# EAGLE design metal detector proto1.1 (EAGLE 9.4.2)
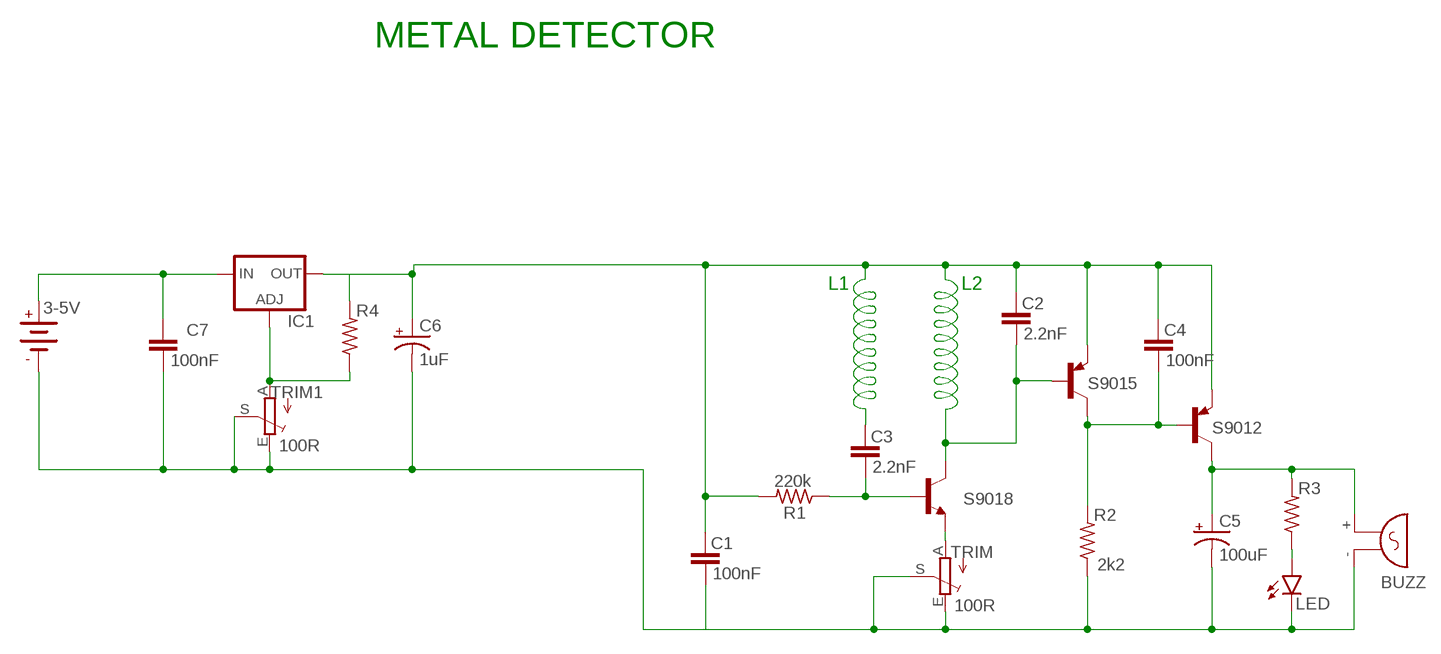
[diagram p0: schematic, sheet 1]

## Parts
3-5V  3-5V  DC_BATT  [AB9V]
BUZZ  F/QMX  [F/QMX]
C1  100nF  CER/FILMBOX.1  [BOX_SMALL]
C2  2.2nF  CER/FILMBOX.1  [BOX_SMALL]
C3  2.2nF  CER/FILMBOX.1  [BOX_SMALL]
C4  100nF  CER/FILMBOX.1  [BOX_SMALL]
C5  100uF  0631  [063_025]
C6  1uF  0631  [063_025]
C7  100nF  CER/FILMBOX.1  [BOX_SMALL]
IC1  LM138-TS  [TO220S]
LED  LED5MM  [LED5MM]
R1  220k  R_.3B  [R0207/3]
R2  2k2  R_.3B  [R0207/3]
R3  R_.3B  [R0207/3]
R4  R_.3B  [R0207/3]
S9012  S9012  [TO92-EBC]
S9015  S9015  [TO92-EBC]
S9018  S9018  [TO92-EBC]
TRIM  100R  TRIM_EU-RJ9W  [RJ9W]
TRIM1  100R  TRIM_EU-RJ9W  [RJ9W]

## Nets
GND: 3-5V.- BUZZ.- C1.2 C5.- C6.- C7.2 LED.K(C) R2.1 TRIM1.E TRIM1.S TRIM.E TRIM.S
N$2: 3-5V.+ C7.1 IC1.3(IN)
N$3: C4.2 R2.2 S9012.2(B) S9015.3(C)
N$4: BUZZ.+ C5.+ R3.2 S9012.3(C)
N$5: LED.A R3.1
N$7: C1.1 C2.1 C2.2 C3.1 C4.1 C6.+ IC1.2(OUT) R1.2 R4.2 S9012.1(E) S9015.1(E) S9015.2(B) S9018.3(C)
N$10: IC1.1(ADJ) R4.1 TRIM1.A
N$15: S9018.1(E) TRIM.A
N$16: C3.2 R1.1 S9018.2(B)

## Notes on the sheet
- METAL DETECTOR
- L1 | L2

## Library data of the parts
3-5V = supply pins:DC_BATT
BUZZ = buzzer:F/QMX: BUZZER Source: Buerklin; OC_FARNELL: unknown; OC_NEWARK: unknown
C1-C4 C7 = capacitors-film:CER/FILM: 47 - 120pF Xicon Ceramic Disc 2.5mm lead spacing
C5 C6 = capacitors-elec:063: 33 - 220uF Xicon values at Mouser.com 10V: 220uF; 16V: 100uF; 25V: 100uF; 50V: 33uF
IC1 = v-reg:LM138-TS: VOLTAGE REGULATOR
LED = diodes_mod:LED
R1-R4 = resistors:R_
S9012 = transistors:S9012
S9015 = transistors:S9015
S9018 = transistors:S9018
TRIM TRIM1 = pot:TRIM_EU-: POTENTIOMETER

## Module LM317
Ports: 

### Library data of the parts

## Board
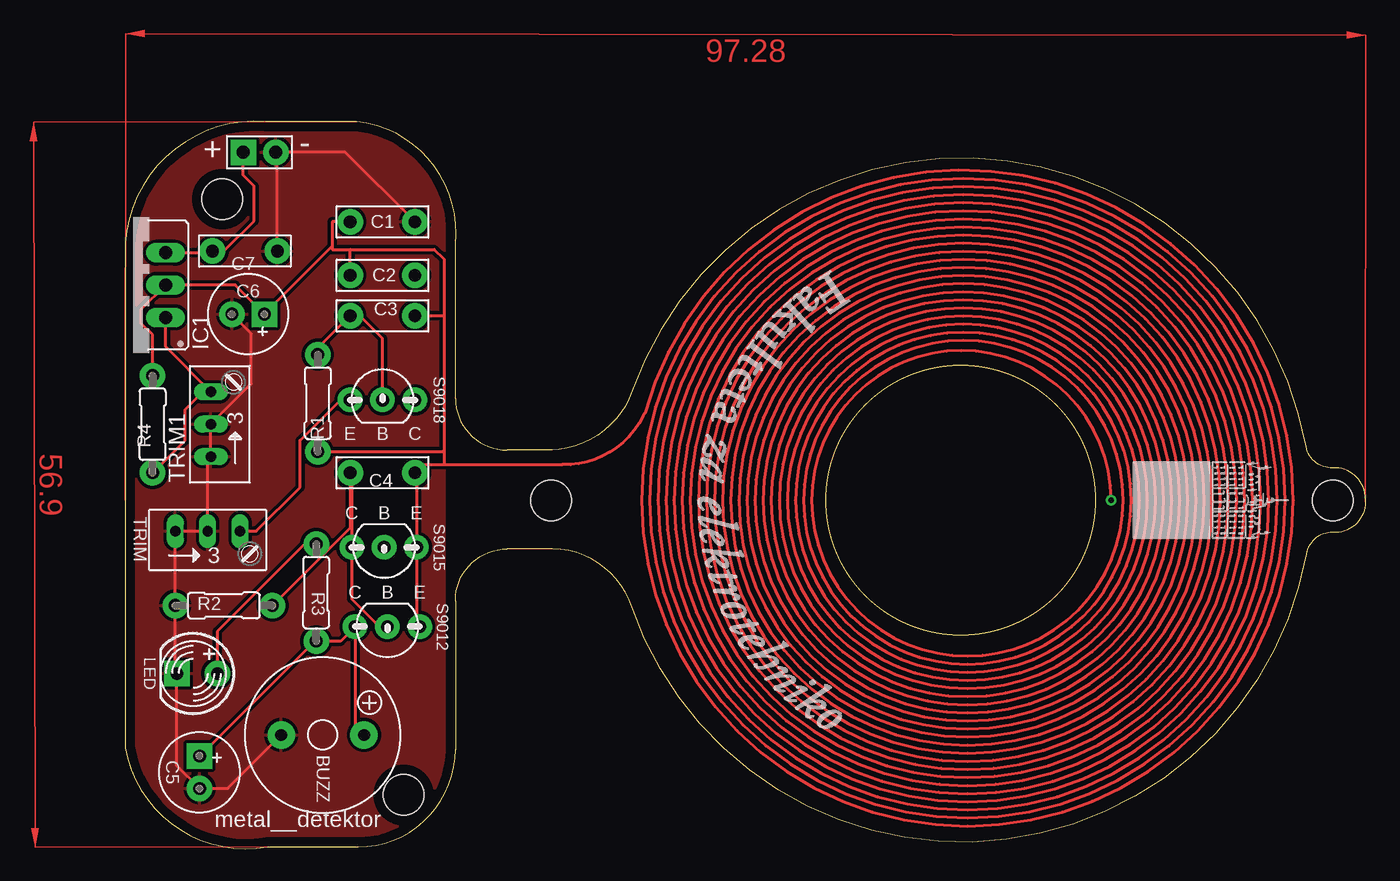
[diagram p1: board, top side]
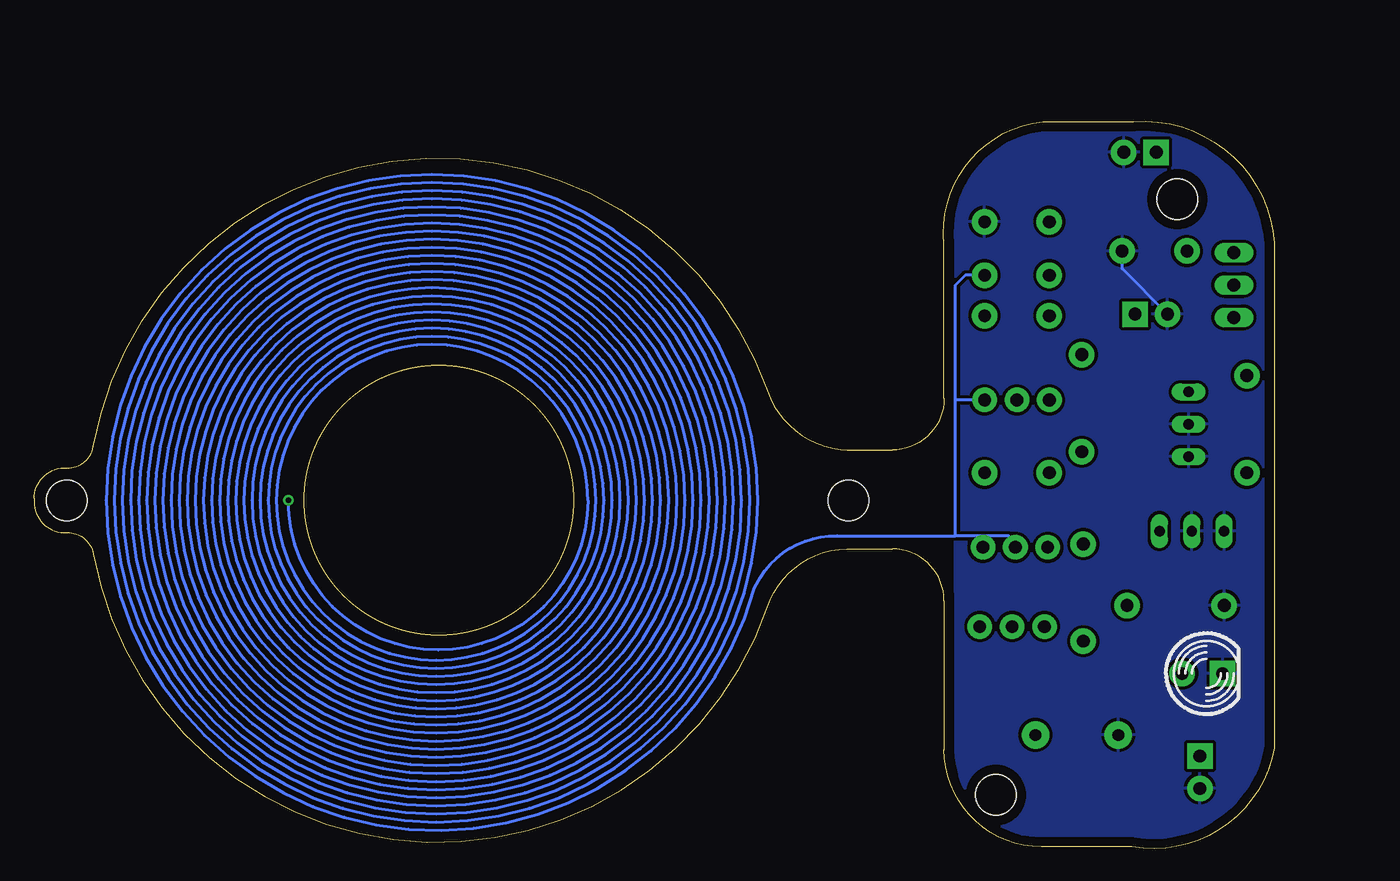
[diagram p2: board, bottom side, seen from below]

Size 97.28 x 57.08 mm. Coordinates in mm from the lower left corner, seen from the top.
Outline: 33.53,31.27 33.4,31.27
Outline: 33.4,31.27 29.97,31.27 arc-90 25.91,35.33 25.91,47.4 arc90 18.16,57.05 11.05,57.05 arc90 0,47.52 0,7.9 arc90 11.18,0.15 18.29,0.15 arc90 25.91,7.77 25.91,19.46 arc-90 29.97,23.52 33.53,23.52 arc-71 39.75,18.95 arc151 92.63,23.12 arc-83 94.74,24.79 arc93 97.28,27.2 97.28,27.46 arc93 94.74,29.87 arc-83 92.63,31.55 arc150 39.78,35.92 arc-69 33.4,31.27
Outline: circle at 65.53,27.33 radius 10.57
Copper layers (1*16): Top 0.035mm / dielectric 1.5mm / Bottom 0.035mm
Design rules "default *": minimum track width 10mil, minimum drill 15mil, track to track 10mil, track to pad 10mil, pad to pad 10mil, via to via 8mil, smd to smd 8mil, copper to edge 30mil, drill to drill 8mil, minimum pad ring 10mil, minimum via ring 8mil, stop-mask expansion 4mil, vias tented up to drill 17mil, thermal gap 10mil
Holes 3.2 mm at 7.62,50.95 21.84,4.22 33.4,27.33 94.74,27.33

### Footprints (pad centres in the part's own frame; a part is rotated, then mirrored left to right if it is on the bottom)
AB9V = drill 1 pad 2 square: + 0,1.27 | drill 1 pad 2: - 0,-1.27
F/QMX = drill 0.914 pad 2.159: + 3.251,0; - -3.251,0
BOX_SMALL = drill 1 pad 2: 1 -2.54,0; 2 2.54,0
063_025 = drill 1 pad 2 square: + -1.27,0 | drill 1 pad 2: - 1.27,0
TO220S = drill 1.016 long: 1 -2.54,-2.54; 2 0,-2.54; 3 2.54,-2.54
LED5MM = drill 1 pad 2: A -1.905,0 | drill 1 pad 2 square: K 1.27,0
R0207/3 = drill 1 pad 2: 1 -3.81,0; 2 3.81,0
TO92-EBC = drill 1 pad 1.93: 1 -2.54,0; 2 0,0; 3 2.54,0
RJ9W = drill 0.813 long: A 2.54,0.635; E -2.54,0.635; S 0,0.635

### Placement (x,y rotation side)
3-5V  10.54,54.64 90 top
BUZZ  15.49,8.92 0 top
C1  20.19,49.18 0 top
C2  20.19,44.98 180 top
C3  20.19,41.81 180 top
C4  20.19,29.49 180 top
C5  5.84,6 270 top
C6  9.65,41.94 180 top
C7  9.4,46.89 0 top
IC1  0.64,44.22 90 top
LED  5.33,13.74 180 top
R1  15.11,34.95 270 top
R2  7.75,19.08 0 top
R3  14.99,20.09 270 top
R4  2.16,33.3 90 top
S9012  20.57,17.43 180 top
S9015  20.32,23.65 180 top
S9018  20.19,35.21 0 top
TRIM  6.48,24.28 0 top
TRIM1  7.37,33.3 90 top

### Tracks (layer width: path | path; a pad name or v marks a point on that pad's centre or on a via)
GND
  Top 0.254: BUZZ.- 8.05,4.73 C5.- 4.06,6.5 LED.K 3.94,13.87 R2.1 TRIM.E TRIM.S 6.48,30.51 TRIM1.E TRIM1.S 9.91,36.48 9.91,40.41 C6.- | C7.2 11.94,54.51 3-5V.- 17.27,54.64 C1.2
  Bottom 0.254: C6.- 11.94,45.49 C7.2
  pour Top: -0.38,57.05 25.02,57.05 25.02,0.41 -0.38,0.41
  pour Bottom: 25.02,57.05 -0.38,57.05 -0.38,0.41 25.02,0.41
N$2
  Top 0.254: IC1.3 6.73,46.76 C7.1 7.75,46.89 10.11,49.25 10.11,51.98 9.27,52.82 3-5V.+
N$3
  Top 0.254: S9012.2 19.94,17.43 17.78,19.58 S9015.3 17.78,29.36 C4.2 17.65,25.17 R2.2
N$4
  Top 0.254: BUZZ.+ 18.03,8.92 S9012.3 | C5.+ 14.86,16.28 R3.2 16.89,16.28 S9012.3 | 17.91,17.55 S9012.3
N$5
  Top 0.254: R3.1 14.1,23.9 7.24,17.04 LED.A
N$7  (via drill 0.41)
  Top 0.254: 25.02,41.81 25.02,46.25 24.26,47.02 17.65,47.02 | 25.02,41.81 25.02,31.27 | 25.02,31.27 25.02,30.13 | 25.02,30.13 23.24,30.13 22.73,29.62 C4.1 22.86,29.36 S9015.1 22.86,17.68 S9012.1 | 25.02,30.13 34.29,30.13 arc65 40.64,33.94 40.77,34.19 arc-165 91.63,27.33 arc-180 40.51,27.33 arc-180 90.99,27.33 arc-180 41.15,27.33 arc-180 90.36,27.33 arc-180 41.78,27.33 arc-180 89.72,27.33 arc-180 42.42,27.33 arc-180 89.09,27.33 arc-180 43.05,27.33 arc-180 88.46,27.33 arc-180 43.69,27.33 arc-180 87.82,27.33 arc-180 44.32,27.33 arc-180 87.19,27.33 arc-180 44.96,27.33 arc-180 86.55,27.33 arc-180 45.59,27.33 arc-180 85.91,27.33 arc-180 46.23,27.33 arc-180 85.28,27.33 arc-180 46.86,27.33 arc-180 84.64,27.33 arc-180 47.5,27.33 arc-180 84.01,27.33 arc-180 48.13,27.33 arc-180 83.38,27.33 arc-180 48.77,27.33 arc-180 82.74,27.33 arc-180 49.4,27.33 arc-180 82.11,27.33 arc-180 50.04,27.33 arc-180 81.47,27.33 arc-180 50.67,27.33 arc-180 80.83,27.33 arc-180 51.31,27.33 arc-180 80.2,27.33 arc-180 51.94,27.33 arc-180 79.57,27.33 arc-180 52.58,27.33 arc-180 78.93,27.33 arc-180 53.21,27.33 arc-180 78.3,27.33 arc-180 53.85,27.33 arc-180 v77.34,27.33 | C3.1 25.02,41.81 | 17.65,47.02 16.26,47.02 16.26,47.27 | 16.26,47.27 16.26,49.18 C1.1 | C2.2 17.65,47.02 | R1.2 24.89,31.14 25.02,31.27 | R4.2 2.16,40.32 1.27,41.21 1.27,42.32 IC1.2 8.64,44.22 C6.+ 16.26,47.27
  Bottom 0.254: 25.02,24.54 34.29,24.54 arc-65 40.64,20.73 40.77,20.47 arc165 91.63,27.33 arc180 40.51,27.33 arc180 90.99,27.33 arc180 41.15,27.33 arc180 90.36,27.33 arc180 41.78,27.33 arc180 89.72,27.33 arc180 42.42,27.33 arc180 89.09,27.33 arc180 43.05,27.33 arc180 88.46,27.33 arc180 43.69,27.33 arc180 87.82,27.33 arc180 44.32,27.33 arc180 87.19,27.33 arc180 44.96,27.33 arc180 86.55,27.33 arc180 45.59,27.33 arc180 85.91,27.33 arc180 46.23,27.33 arc180 85.28,27.33 arc180 46.86,27.33 arc180 84.64,27.33 arc180 47.5,27.33 arc180 84.01,27.33 arc180 48.13,27.33 arc180 83.38,27.33 arc180 48.77,27.33 arc180 82.74,27.33 arc180 49.4,27.33 arc180 82.11,27.33 arc180 50.04,27.33 arc180 81.47,27.33 arc180 50.67,27.33 arc180 80.83,27.33 arc180 51.31,27.33 arc180 80.2,27.33 arc180 51.94,27.33 arc180 79.57,27.33 arc180 52.58,27.33 arc180 78.93,27.33 arc180 53.21,27.33 arc180 78.3,27.33 arc180 53.85,27.33 arc180 v77.34,27.33 | 25.02,24.54 25.02,35.21 | 25.02,35.21 25.02,44.22 24.26,44.98 C2.1 | S9015.2 20.32,24.03 20.83,24.54 25.02,24.54 | S9018.3 25.02,35.21
N$10
  Top 0.254: R4.1 4.7,32.03 4.7,34.44 6.1,35.84 TRIM1.A 3.17,39.4 IC1.1
N$15
  Top 0.254: TRIM.A 10.29,24.92 13.72,28.35 13.72,32.03 16.89,35.21 S9018.1
N$16
  Top 0.254: S9018.2 20.19,40.03 18.41,41.81 C3.2 15.11,39.27 R1.1
(copper drawn outside any net)
  shapes: Top area x2

### Text on the board
tPlace: + | -
tNames: metal__detektor